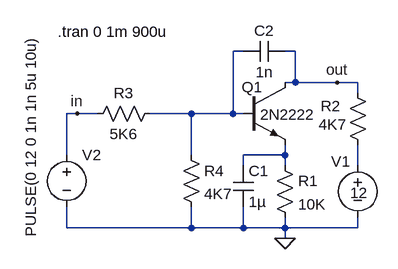
[diagram p0: schematic 1Q_Integ.asc]
1Q_Integ.asc, the LTspice schematic file:
Version 4
SHEET 1 880 680
WIRE -288 256 -288 192
WIRE -288 368 -288 336
WIRE -272 192 -288 192
WIRE -240 192 -272 192
WIRE -96 192 -160 192
WIRE -96 256 -96 192
WIRE -96 368 -288 368
WIRE -96 368 -96 336
WIRE -32 192 -96 192
WIRE -32 192 -32 96
WIRE -16 96 -32 96
WIRE -16 192 -32 192
WIRE -16 272 -16 256
WIRE -16 368 -96 368
WIRE -16 368 -16 336
WIRE 48 256 -16 256
WIRE 48 256 48 240
WIRE 48 272 48 256
WIRE 48 368 -16 368
WIRE 48 368 48 352
WIRE 48 384 48 368
WIRE 64 96 48 96
WIRE 64 144 48 144
WIRE 64 144 64 96
WIRE 128 144 64 144
WIRE 160 144 128 144
WIRE 160 160 160 144
WIRE 160 272 160 240
WIRE 160 368 48 368
WIRE 160 368 160 352
FLAG 48 384 0
FLAG -272 192 in
FLAG 128 144 out
SYMBOL npn2 -16 144 R0
WINDOW 0 -3 7 Left 0
WINDOW 3 26 49 Left 0
SYMATTR InstName Q1
SYMATTR Value 2N2222
SYMBOL res 32 256 R0
SYMATTR InstName R1
SYMATTR Value 10K
SYMATTR SpiceLine tol=1 pwr=0.1
SYMBOL cap -32 272 R0
SYMATTR InstName C1
SYMATTR Value 1µ
SYMATTR SpiceLine V=10 Irms=10.541 Rser=0.004 MTBF=0 Lser=1.25p mfg="KEMET" pn="C0603C105K8PAC" type="X5R" ppPkg=1
SYMBOL cap 48 80 R90
WINDOW 0 0 32 VBottom 0
WINDOW 3 32 32 VTop 0
SYMATTR InstName C2
SYMATTR Value 1n
SYMBOL res 144 144 R0
WINDOW 0 -41 36 Left 0
WINDOW 3 -44 65 Left 0
SYMATTR InstName R2
SYMATTR Value 4K7
SYMATTR SpiceLine tol=1 pwr=0.1
SYMBOL res -144 176 R90
WINDOW 0 0 56 VBottom 0
WINDOW 3 32 56 VTop 0
SYMATTR InstName R3
SYMATTR Value 5K6
SYMATTR SpiceLine tol=1 pwr=0.1
SYMBOL voltage 160 256 R0
WINDOW 0 -41 10 Left 0
WINDOW 3 -12 58 Left 0
WINDOW 123 0 0 Left 0
SYMATTR InstName V1
SYMATTR Value 12
SYMATTR SpiceLine Rser=1 Cpar=1n
SYMBOL voltage -288 240 R0
WINDOW 3 -55 -168 VRight 0
WINDOW 123 0 0 Left 0
WINDOW 39 0 0 Left 0
SYMATTR InstName V2
SYMATTR Value PULSE(0 12 0 1n 1n 5u 10u)
SYMBOL res -112 240 R0
SYMATTR InstName R4
SYMATTR Value 4K7
SYMATTR SpiceLine tol=1 pwr=0.1
TEXT -302 66 Left 0 !.tran 0 1m 900u

The netlist it stands for:
* 1Q_Integ.asc
Q1 out N001 N002 0 2N2222
R1 N002 0 10K tol=1 pwr=0.1
C1 N002 0 1µ V=10 Irms=10.541 Rser=0.004 MTBF=0 Lser=1.25p mfg="KEMET" pn="C0603C105K8PAC" type="X5R" ppPkg=1
C2 out N001 1n
R2 out N003 4K7 tol=1 pwr=0.1
R3 N001 in 5K6 tol=1 pwr=0.1
V1 N003 0 12 Rser=1 Cpar=1n
V2 in 0 PULSE(0 12 0 1n 1n 5u 10u)
R4 N001 0 4K7 tol=1 pwr=0.1
.model NPN NPN
.model PNP PNP
.lib standard.bjt
.tran 0 1m 900u
.backanno
.end